# Altium schematic sheet Sheet1.SchDoc
size A4; SheetNumber: 2; SheetTotal: 2
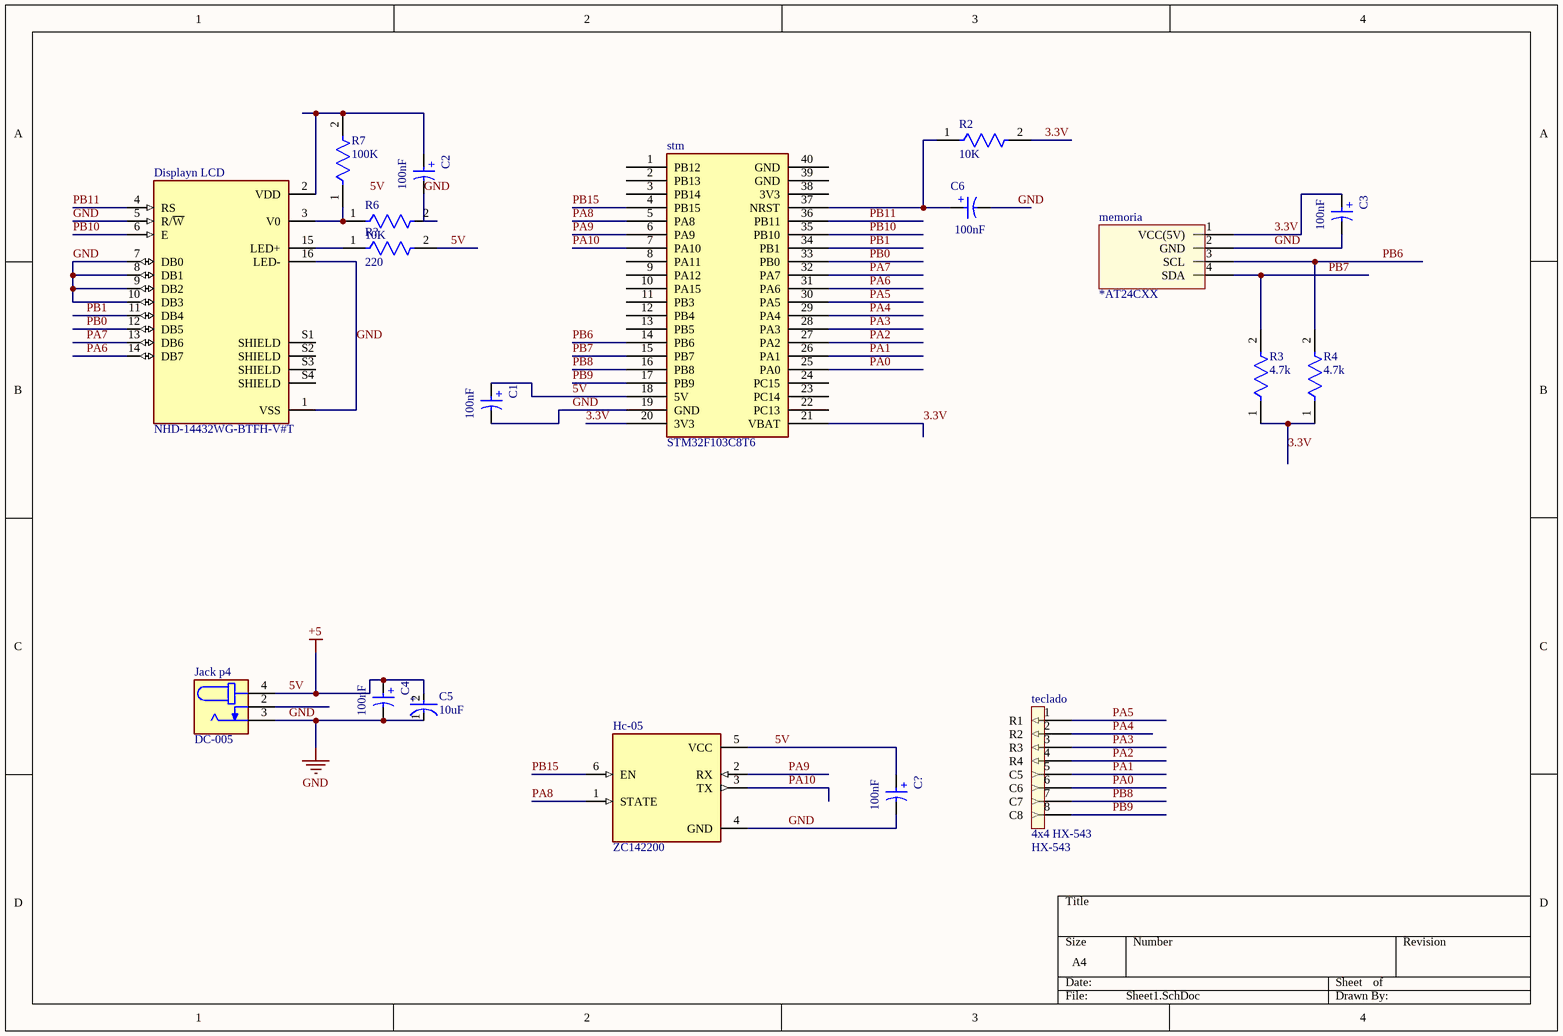
[diagram p0: Sheet1.SchDoc]

## Parts
C1  100nF  [WCAP-ATG8_D5H11]
C2  100nF  [WCAP-ATG8_D5H11]
C3  100nF  [WCAP-ATG8_D5H11]
C4  100nF  [WCAP-ATG8_D5H11]
C5  10uF  [FP-RAD-TH-D_5_0_5-L_11_1-MFG]
C6  100nF  [WCAP-ATG8_D5H11]
C?  100nF  [WCAP-ATG8_D5H11]
Displayn_LCD  NHD-14432WG-BTFH-V#T  [LCD_NHD-14432WG-BTFH-V#T]
Hc-05  ZC142200  [MODULE_ZC142200]
Jack_p4  DC-005  [NINIGI_DC-005]
memoria  Parameter 1: *AT24CXX  [memória]  (hidden comment: memória)
R2  10K  [FP-MF0207-MFG]
R3  4.7k  [FP-RCMM02-MFG]
R4  4.7k  [FP-RCMM02-MFG]
R6  10K  [FP-MF0207-MFG]
R7  100K  [FP-PR02000201003JA100-MFG]
R?  220  [FP-MBA0204-MFG]
stm  STM32F103C8T6  [Stm32 BluePill]
teclado  4x4 HX-543  value HX-543  [Teclado]

## Nets
5V: C1.1(P) C4.1(P) C5.2(A) C?.1(P) Hc-05.5(VCC) Jack_p4.4 R?.2 stm.18(5V)  [also labelled +5]
GND: C1.2(N) C2.2(N) C3.2(N) C4.2(N) C5.1(C) C6.2(N) C?.2(N) Displayn_LCD.1(VSS) Displayn_LCD.5(R/~{W}) Displayn_LCD.7(DB0) Displayn_LCD.8(DB1) Displayn_LCD.9(DB2) Displayn_LCD.10(DB3) Displayn_LCD.16(LED-) Hc-05.4(GND) Jack_p4.3 memoria.2(GND) R6.2 stm.19(GND)
3.3V: C3.1(P) memoria.1(VCC(5V)) R2.2 R3.1 R4.1 stm.20(3V3) stm.21(VBAT)
PA0: stm.25(PA0) teclado.6(C6)
PA1: stm.26(PA1) teclado.5(C5)
PA2: stm.27(PA2) teclado.4(R4)
PA3: stm.28(PA3) teclado.3(R3)
PA4: stm.29(PA4) teclado.2(R2)
PA5: stm.30(PA5) teclado.1(R1)
PA6: Displayn_LCD.14(DB7) stm.31(PA6)
PA7: Displayn_LCD.13(DB6) stm.32(PA7)
PA8: Hc-05.1(STATE) stm.5(PA8)
PA9: Hc-05.2(RX) stm.6(PA9)
PA10: Hc-05.3(TX) stm.7(PA10)
PB0: Displayn_LCD.12(DB5) stm.33(PB0)
PB1: Displayn_LCD.11(DB4) stm.34(PB1)
PB6: memoria.3(SCL) R4.2 stm.14(PB6)
PB7: memoria.4(SDA) R3.2 stm.15(PB7)
PB8: stm.16(PB8) teclado.7(C7)
PB9: stm.17(PB9) teclado.8(C8)
PB10: Displayn_LCD.6(E) stm.35(PB10)
PB11: Displayn_LCD.4(RS) stm.36(PB11)
PB15: Hc-05.6(EN) stm.4(PB15)
NetC2_1: C2.1(P) Displayn_LCD.2(VDD) R7.2
NetC6_1: C6.1(P) R2.1 stm.37(NRST)
NetDisplayn_LCD_3: Displayn_LCD.3(V0) R6.1 R7.1
NetDisplayn_LCD_15: Displayn_LCD.15(LED+) R?.1

Not connected (* = marked no-connect by the designer): Displayn_LCD S1(SHIELD) S2(SHIELD) S3(SHIELD) S4(SHIELD); Jack_p4 2(4); stm 1(PB12) 2(PB13) 3(PB14) 8(PA11) 9(PA12) 10(PA15) 11(PB3) 12(PB4) 13(PB5) 22(PC13) 23(PC14) 24(PC15) 38(3V3) 39(GND) 40(GND)

## Notes on the sheet
- Labels drawn without touching a wire or pin: 5V
- (in symbol CMP-03913-53914132-2) +
- (in symbol CMP-05427-000260-1) +

## Library data of the parts
C1-C4 C6 C? = CMP-03913-53914132-2: Alum. Electrolytic Cap 100NF 63V 5MM Radial WCAP-ATG8; Lifetime 2000H +85°C; Leakage Current: 3µA; Pitch: 2mm; Ripple Current: 4mA; Tolerance: 20%; Life (Hours): 2000hours; Polarity: Polar; Lead Pitch: 2.0066mm; Diameter: 5mm; Voltage Rating (DC): 63V; Mount: Through Hole; Case/Package: Radial; Packaging: Tape & Box (TB); Capacitance: 100nF; Voltage Rating: 63V; Max Operating Temperature: 85°C; Height - Seated (Max): 12.4968mm; Height: 11mm; Length: 11mm; Min Operating Temperature: -40°C; REACH SVHC: Unknown; RoHS: Compliant
C5 = CMP-05427-000260-1: Aluminum Electrolytic Capacitors (Radial Lead Type) AEC-Q200 Qualified 10uF ±20% 50V; Lead Diameter: 0.5mm; Polarity: Polar; Leakage Current: 3uA; Life (Hours): 1000Hour; Ripple Current: 39mA; Lead/Base Style: Straight; Max Operating Temperature: 105°C; Voltage Rating (DC): 50V; Diameter: 5mm; RoHS Compliant: Yes; Capacitance: 10uF; Packaging: Ammo Pack; Series: NHG; Construction: RADIAL; Length: 11mm; Tolerance: 20%; Height - Seated (Max): 0.472inch; Contact Plating: Tin; Height: 11mm; Min Operating Temperature: -55°C; Radiation Hardening: No; Package Quantity: 2000; Mount: Through Hole; Voltage Rating: 50V; Lead Pitch: 2.5mm; Termination: Radial; Lead Free: Lead Free; Case/Package: Radial
Displayn_LCD = NHD-14432WG-BTFH-V#T: - Graphic LCD Display Module Transflective Black (White - Inverted) FSTN - Film Super-Twisted Nematic Parallel, 8-Bit - 144 x 32; MF: Newhaven Display; SnapEDA_Link: https://www.snapeda.com/parts/NHD-14432WG-BTFH-V%23T/Newhaven+Display+Intl/view-part/?ref=snap; Package: None; MP: NHD-14432WG-BTFH-V#T; Check_prices: https://www.snapeda.com/parts/NHD-14432WG-BTFH-V%23T/Newhaven+Display+Intl/view-part/?ref=eda; Purchase-URL: https://pricing.snapeda.com/search/part/NHD-14432WG-BTFH-V#T/?ref=eda; Price: None; Value: *; Availability: In Stock
Hc-05 = ZC142200: 1pc HC-05 6 Pin Wireless Bluetooth RF Transceiver Module Serial For Arduino; MF: YKS; SnapEDA_Link: https://www.snapeda.com/parts/ZC142200/YKS/view-part/?ref=snap; Package: None; Value: *; MP: ZC142200; Check_prices: https://www.snapeda.com/parts/ZC142200/YKS/view-part/?ref=eda
Jack_p4 = DC-005: DC Jack; Availability: Unavailable; MP: DC-005; Value: *; Package: None; Price: None
memoria = memoria: AT24CXX
R2 R6 = CMP-03413-000006-1: RES 10K OHM 1% 0.6W AXIAL; Temperature Coefficient: 50ppm/°C; Resistance: 10kR; Mount: Through Hole; Radiation Hardening: No; Tolerance: 1%; Construction: Cylindrical; Contact Plating: Tin; Case/Package: Conformal; Resistor Type: Metal Film; Min Operating Temperature: -55°C; Military Standard: Not; Lead Free: Lead Free; Diameter: 2.4mm; Termination: Axial; Max Operating Temperature: 155°C; RoHS Compliant: Yes; Packaging: Ammo Pack; Length: 6.3mm
R3 R4 = CMP-02408-000034-1: RES 4.7K OHM 2% 1/2W AXIAL; Temperature Coefficient: 100ppm/°C; Resistance: 4.7kR; RoHS Compliant: Yes; Contact Plating: Tin; Tolerance: 2%; Diameter: 2.5mm; Case/Package: Molded; Length: 6.5mm; Mount: Through Hole; Resistor Type: Metal Film
R7 = CMP-00030-42817933-1: PR02000201003JA100 Fixed Resistor, Metal Film, 2W, 100000ohm, 500V, 5% +/-Tol, 250ppm/Cel, Through Hole Mount; Resistance: 100kΩ; Temperature Coefficient: 250ppm/°C; Case/Package: Conformal; Lead Free: Lead Free; Composition: Metal Film; Schedule B: 8533210090, 8533210090; Tolerance: 5%; RoHS: Compliant; Min Operating Temperature: -55°C; NexarPartId: 42817933; Diameter: 3.9mm; Max Operating Temperature: 155°C; Voltage Rating: 500V; Length: 12mm; Width: 3.9mm; Contact Plating: Tin; REACH SVHC: No SVHC; Operating Supply Voltage: 500V; Termination: Axial; Power Rating: 2W; Military Standard: Not; Radiation Hardening: No; Mount: Through Hole; Voltage Rating (DC): 500V
R? = CMP-02408-000005-1: RES 220 OHM 0.4W 1% AXIAL; Manufacturer Part Number: MBA02040C2200FC100; Manufacturer: Vishay BC Components; Automotive Grade: Grade 1; Value: 220Ω; Voltage Rating: 200V; Temperature Coefficient: 50ppm/°C; Power Rating: 0.25W; Digikey Description: RES 220 OHM 0.4W 1% AXIAL; Height: 1.6mm; Automotive: Yes; Lead Free: Yes; Mouser Description: Thin Film Resistors - Through Hole .4watt 220ohms 1% 1/8watt body size; Temperature Range Low: -55°C; ComponentLink2Description: Datasheet; Temperature: -55°C to +125°C; Device Class L3: Through-Hole Resistors; Ipc Land Pattern Name: RESAD500W65L360D160; Octopart: https://octopart.com/mba02040c2200fc100-vishay-43743094; Series: MBA/SMA 0204; RoHS: TRUE; Tolerance: 1%; Package: MBA0204; Device Class L1: Passive Components; ComponentLink2URL: http://www.vishay.com/docs/28766/mbxsma.pdf; Category: Res; Composition: Metal Film; Device Class L2: Resistors; Temperature Range High: +125°C; Resistance: 220Ω
stm = BluePill: Designed By @Alixahedi
teclado = teclado: teclado 4x4 HX-543; pin to pad: 1>R1 2>R2 3>R3 4>R4 5>C1 6>C2 7>C3 8>C4